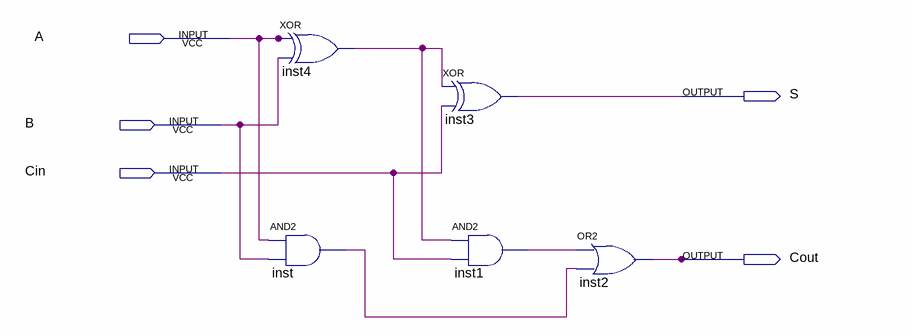
[diagram p0: schematic sheet]
// Quartus schematic fulladder.bdf as structural Verilog: 5 symbols, 5 pins
module fulladder (
  input  A,
  input  B,
  input  Cin,
  output S,
  output Cout
);

  wire inst1_out, inst4_out, inst_out;

  xor inst4 (inst4_out, A, B);
  and inst (inst_out, A, B);
  xor inst3 (S, inst4_out, Cin);
  and inst1 (inst1_out, inst4_out, Cin);
  or inst2 (Cout, inst1_out, inst_out);
endmodule
